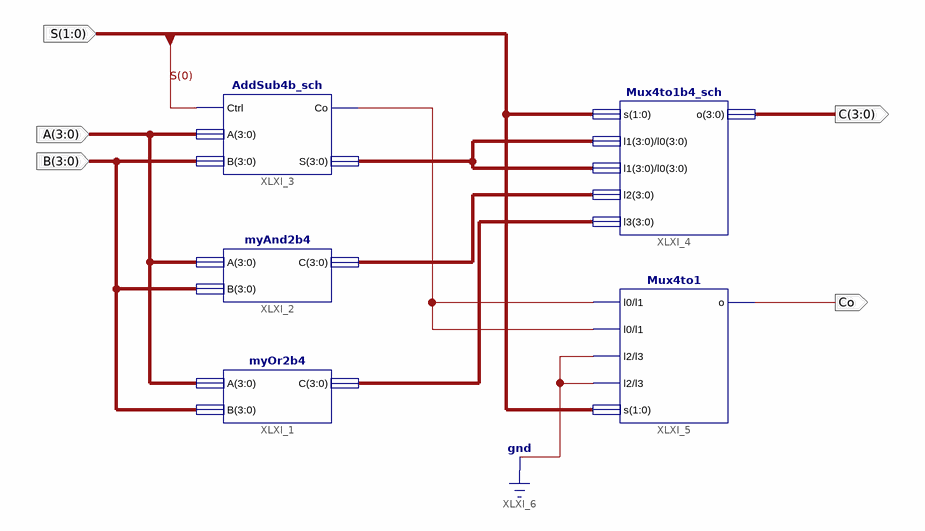
[diagram p0: schematic sheet 1]
// Xilinx ISE schematic ALU4b.sch (kintex7) as structural Verilog: 5 symbols, 5 ports
module ALU4b (
  input  [1:0] S,
  input  [3:0] A,
  input  [3:0] B,
  output [3:0] C,
  output Co
);

  wire XLXN_15;
  wire [3:0] XLXN_5, XLXN_7, XLXN_8;

  myOr2b4 XLXI_1 (.A(A), .B(B), .C(XLXN_8));
  myAnd2b4 XLXI_2 (.A(A), .B(B), .C(XLXN_7));
  AddSub4b_sch XLXI_3 (.Ctrl(S[0]), .A(A), .B(B), .Co(XLXN_15), .S(XLXN_5));
  Mux4to1b4_sch XLXI_4 (.s(S), .l1(XLXN_5), .l0(XLXN_5), .l2(XLXN_7), .l3(XLXN_8), .o(C));
  Mux4to1 XLXI_5 (.l0(XLXN_15), .l1(XLXN_15), .l2(1'b0), .l3(1'b0), .s(S), .o(Co));
endmodule
